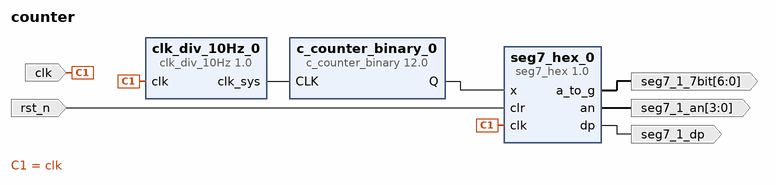
[diagram p0: block diagram of the top level]
# Vivado block design counter, xc7a35tcsg324-1, Vivado 2017.4
create_bd_design counter

create_bd_port -dir I -type clk clk
create_bd_port -dir I rst_n
create_bd_port -dir O -from 6 -to 0 seg7_1_7bit
create_bd_port -dir O -from 3 -to 0 seg7_1_an
create_bd_port -dir O seg7_1_dp

create_bd_cell -type ip -vlnv xilinx.com:user:clk_div_10Hz:1.0 clk_div_10Hz_0
create_bd_cell -type ip -vlnv xilinx.com:ip:c_counter_binary:12.0 c_counter_binary_0
create_bd_cell -type ip -vlnv xilinx.com:user:seg7_hex:1.0 seg7_hex_0

# ---- connections ----

connect_bd_net [get_bd_pins clk_div_10Hz_0/clk_sys] [get_bd_pins c_counter_binary_0/CLK]
connect_bd_net [get_bd_pins c_counter_binary_0/Q] [get_bd_pins seg7_hex_0/x]
connect_bd_net -net clk_0_1 [get_bd_ports clk] [get_bd_pins clk_div_10Hz_0/clk] [get_bd_pins seg7_hex_0/clk]
connect_bd_net [get_bd_ports rst_n] [get_bd_pins seg7_hex_0/clr]
connect_bd_net [get_bd_pins seg7_hex_0/a_to_g] [get_bd_ports seg7_1_7bit]
connect_bd_net [get_bd_pins seg7_hex_0/an] [get_bd_ports seg7_1_an]
connect_bd_net [get_bd_pins seg7_hex_0/dp] [get_bd_ports seg7_1_dp]

validate_bd_design
save_bd_design
